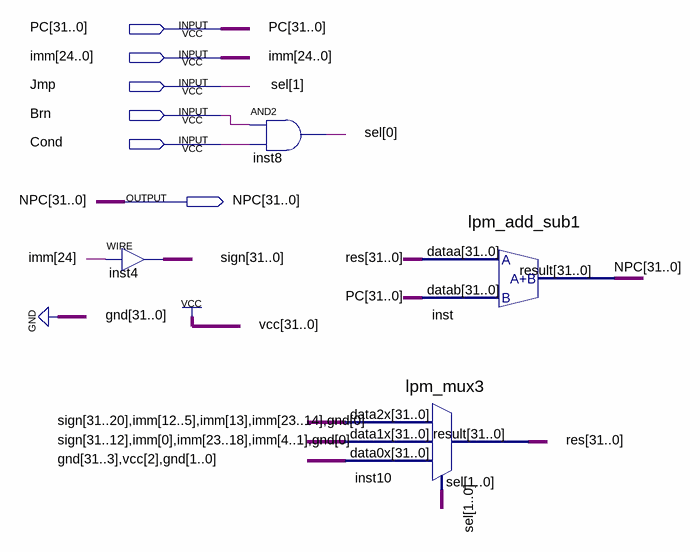
[diagram p0: schematic sheet]
// Quartus schematic ACU.bdf as structural Verilog: 4 symbols, 6 pins
module ACU (
  input  [31:0] PC,
  input  [24:0] imm,
  input  Jmp,
  input  Brn,
  input  Cond,
  output [31:0] NPC
);

  wire [0:0] sel;
  wire [31:0] res, sign;

  assign sign = {32{imm[24]}};  // WIRE inst4
  and inst8 (sel[0], Brn, Cond);
  lpm_mux3 inst10 (
    .data2x({sign[31:20], imm[12:5], imm[13], imm[23:14], 1'b0}),
    .data1x({sign[31:12], imm[0], imm[23:18], imm[4:1], 1'b0}),
    .data0x(32'b00000000000000000000000000000100), .sel({Jmp, sel[0]}), .result(res));
  lpm_add_sub1 inst (.dataa(res), .datab(PC), .result(NPC));

  // Other names for the same wires on the sheet: sel[1] = Jmp
endmodule
